# Altium schematic sheet FMC PWR.SchDoc: TEBF0808 - FMC
size A4; Organization: Trenz Electronic GmbH; DocumentNumber: TEBF0808; Revision: 04; SheetNumber: 17; SheetTotal: 36; Date: 2016-09-29; CompanyName: Trenz Electronic GmbH; ProjectName: TEB0808 - LAN9514
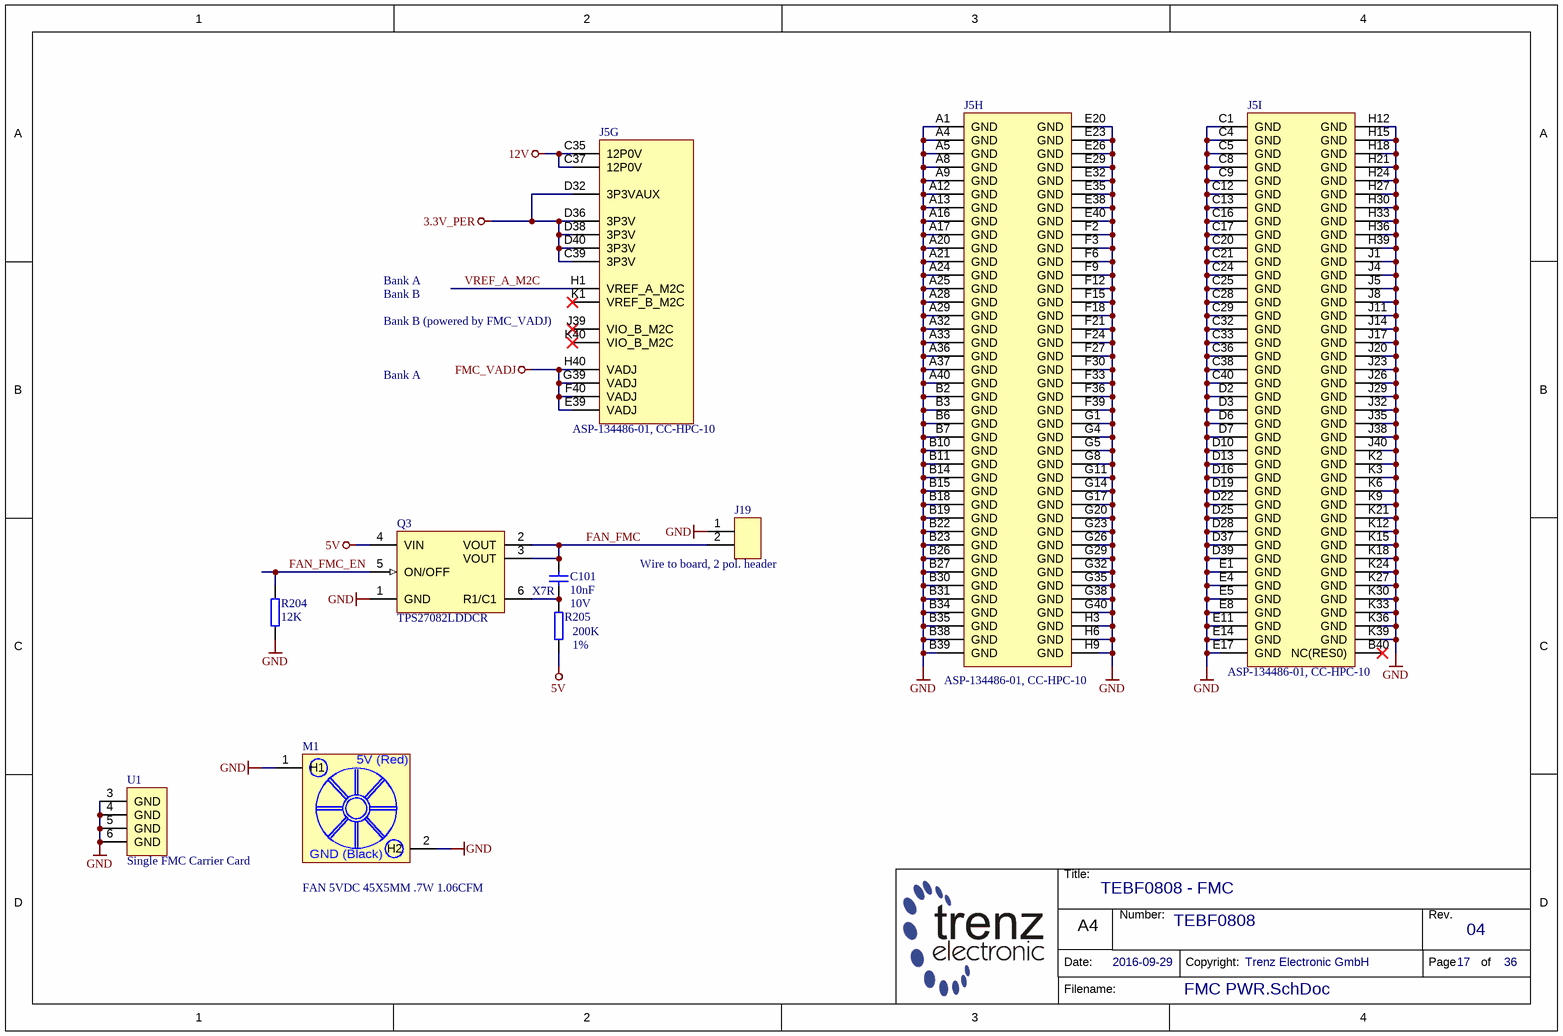
[diagram p0: FMC PWR.SchDoc]

## Parts
C101  10nF  Voltage: 10V  Technology: X7R  [CAPC0603X33N]
J5  ASP-134486-01, CC-HPC-10  [ASP-134486-01B]  (parts G,H,I of 9)
J19  Wire to board, 2 pol. header  [Molex22-27-2021]
M1  FAN 5VDC 45X5MM .7W 1.06CFM  [F455B-05MD]
Q3  TPS27082LDDCR  [SOT95P280X110-6N]
R204  12K  [RESC1005X40N]
R205  200K  Tolerance: 1%  [RESC1005X40N]
U1  Single FMC Carrier Card  [FMC-MM-Single-Base]

## Nets
3.3V_PER: J5.C39(3P3V) J5.D32(3P3VAUX) J5.D36(3P3V) J5.D38(3P3V) J5.D40(3P3V)
5V: Q3.4(VIN) R205.2
12V: J5.C35(12P0V) J5.C37(12P0V)
FMC_VADJ: J5.E39(VADJ) J5.F40(VADJ) J5.G39(VADJ) J5.H40(VADJ)
GND: J5.A1(GND) J5.A4(GND) J5.A5(GND) J5.A8(GND) J5.A9(GND) J5.A12(GND) J5.A13(GND) J5.A16(GND) J5.A17(GND) J5.A20(GND) J5.A21(GND) J5.A24(GND) J5.A25(GND) J5.A28(GND) J5.A29(GND) J5.A32(GND) J5.A33(GND) J5.A36(GND) J5.A37(GND) J5.A40(GND) J5.B2(GND) J5.B3(GND) J5.B6(GND) J5.B7(GND) J5.B10(GND) J5.B11(GND) J5.B14(GND) J5.B15(GND) J5.B18(GND) J5.B19(GND) J5.B22(GND) J5.B23(GND) J5.B26(GND) J5.B27(GND) J5.B30(GND) J5.B31(GND) J5.B34(GND) J5.B35(GND) J5.B38(GND) J5.B39(GND) J5.C1(GND) J5.C4(GND) J5.C5(GND) J5.C8(GND) J5.C9(GND) J5.C12(GND) J5.C13(GND) J5.C16(GND) J5.C17(GND) J5.C20(GND) J5.C21(GND) J5.C24(GND) J5.C25(GND) J5.C28(GND) J5.C29(GND) J5.C32(GND) J5.C33(GND) J5.C36(GND) J5.C38(GND) J5.C40(GND) J5.D2(GND) J5.D3(GND) J5.D6(GND) J5.D7(GND) J5.D10(GND) J5.D13(GND) J5.D16(GND) J5.D19(GND) J5.D22(GND) J5.D25(GND) J5.D28(GND) J5.D37(GND) J5.D39(GND) J5.E1(GND) J5.E4(GND) J5.E5(GND) J5.E8(GND) J5.E11(GND) J5.E14(GND) J5.E17(GND) J5.E20(GND) J5.E23(GND) J5.E26(GND) J5.E29(GND) J5.E32(GND) J5.E35(GND) J5.E38(GND) J5.E40(GND) J5.F2(GND) J5.F3(GND) J5.F6(GND) J5.F9(GND) J5.F12(GND) J5.F15(GND) J5.F18(GND) J5.F21(GND) J5.F24(GND) J5.F27(GND) J5.F30(GND) J5.F33(GND) J5.F36(GND) J5.F39(GND) J5.G1(GND) J5.G4(GND) J5.G5(GND) J5.G8(GND) J5.G11(GND) J5.G14(GND) J5.G17(GND) J5.G20(GND) J5.G23(GND) J5.G26(GND) J5.G29(GND) J5.G32(GND) J5.G35(GND) J5.G38(GND) J5.G40(GND) J5.H3(GND) J5.H6(GND) J5.H9(GND) J5.H12(GND) J5.H15(GND) J5.H18(GND) J5.H21(GND) J5.H24(GND) J5.H27(GND) J5.H30(GND) J5.H33(GND) J5.H36(GND) J5.H39(GND) J5.J1(GND) J5.J4(GND) J5.J5(GND) J5.J8(GND) J5.J11(GND) J5.J14(GND) J5.J17(GND) J5.J20(GND) J5.J23(GND) J5.J26(GND) J5.J29(GND) J5.J32(GND) J5.J35(GND) J5.J38(GND) J5.J40(GND) J5.K2(GND) J5.K3(GND) J5.K6(GND) J5.K9(GND) J5.K12(GND) J5.K15(GND) J5.K18(GND) J5.K21(GND) J5.K24(GND) J5.K27(GND) J5.K30(GND) J5.K33(GND) J5.K36(GND) J5.K39(GND) J19.1 M1.1(H1) M1.2(H2) Q3.1(GND) R204.2 U1.3(GND) U1.4(GND) U1.5(GND) U1.6(GND)
FAN_FMC: C101.1 J19.2 Q3.2(VOUT) Q3.3(VOUT)
FAN_FMC_EN: Q3.5(ON/OFF) R204.1
VREF_A_M2C: J5.H1(VREF_A_M2C)
NetC101_2: C101.2 Q3.6(R1/C1) R205.1

Not connected (* = marked no-connect by the designer): J5 B40(NC(RES0))* J39(VIO_B_M2C)* K1(VREF_B_M2C)* K40(VIO_B_M2C)*

## Notes on the sheet
- Bank A
- Bank B
- (near J5) Bank B (powered by FMC_VADJ)
- Title:
- Number:
- Rev.
- Date:
- A4
- Copyright:
- Page
- of
- Filename:
- (in symbol 25328) 5V (Red); GND (Black)

## Library data of the parts
C101 = 26312: KON 10nF X7R 10V SMD 10%; AN: 26312; Value: 10n; Mixed: SMT; Preferred: Yes; Case: 0603 (0201); Tolerance: 10%
J5 = 24851: ASP-134486-01 female, CC-HPC-10; AN: 24851; Mixed: SMT; Trenz-Stock: Yes; HelpURL: B:\AD\adlib\datasheet\Samtec; H-ART: ASP-134486-01
J19 = 25507: Wire to board, 2 pol. header 0°; AN: 25507; Mixed: THT; HelpURL: B:\AD\adlib\datasheet\AE6410; H-ART: 22-27-2021
M1 = 25328: AN: 25328; Trenz-Stock: Yes; Mixed: MECH; HelpURL: B:\AD\adlib\datasheet\F455B; H-ART: F455B-05MD
Q3 = 25004: AN: 25004; Trenz-Stock: Yes; Mixed: SMT; Case: SOT23-6; HelpURL: B:\AD\adlib\datasheet\TPS27082L; Preferred: Yes; H-ART: TPS27082LDDCR
R204 = 22598: WID SMD 12K 1% 0,063W; AN: 22598; Mixed: SMT; Preferred: Yes; Tolerance: 1%; Case: 1005 (0402); Technology: TK100; Value: 12K
R205 = 23846: WID SMD 200K 1% 0,063W; AN: 23846; Mixed: SMT; Preferred: Yes; Case: 1005 (0402); Value: 200K; Technology: TK100
U1 = 25453: FMC-MM-Single PCB Baseboard Snap; AN: 25453; Mixed: MECH; Case: Single; HelpURL: B:\AD\adlib\datasheet\FMC Mezzanine Module